# EAGLE design Motorcontroller (EAGLE 9.6.0)
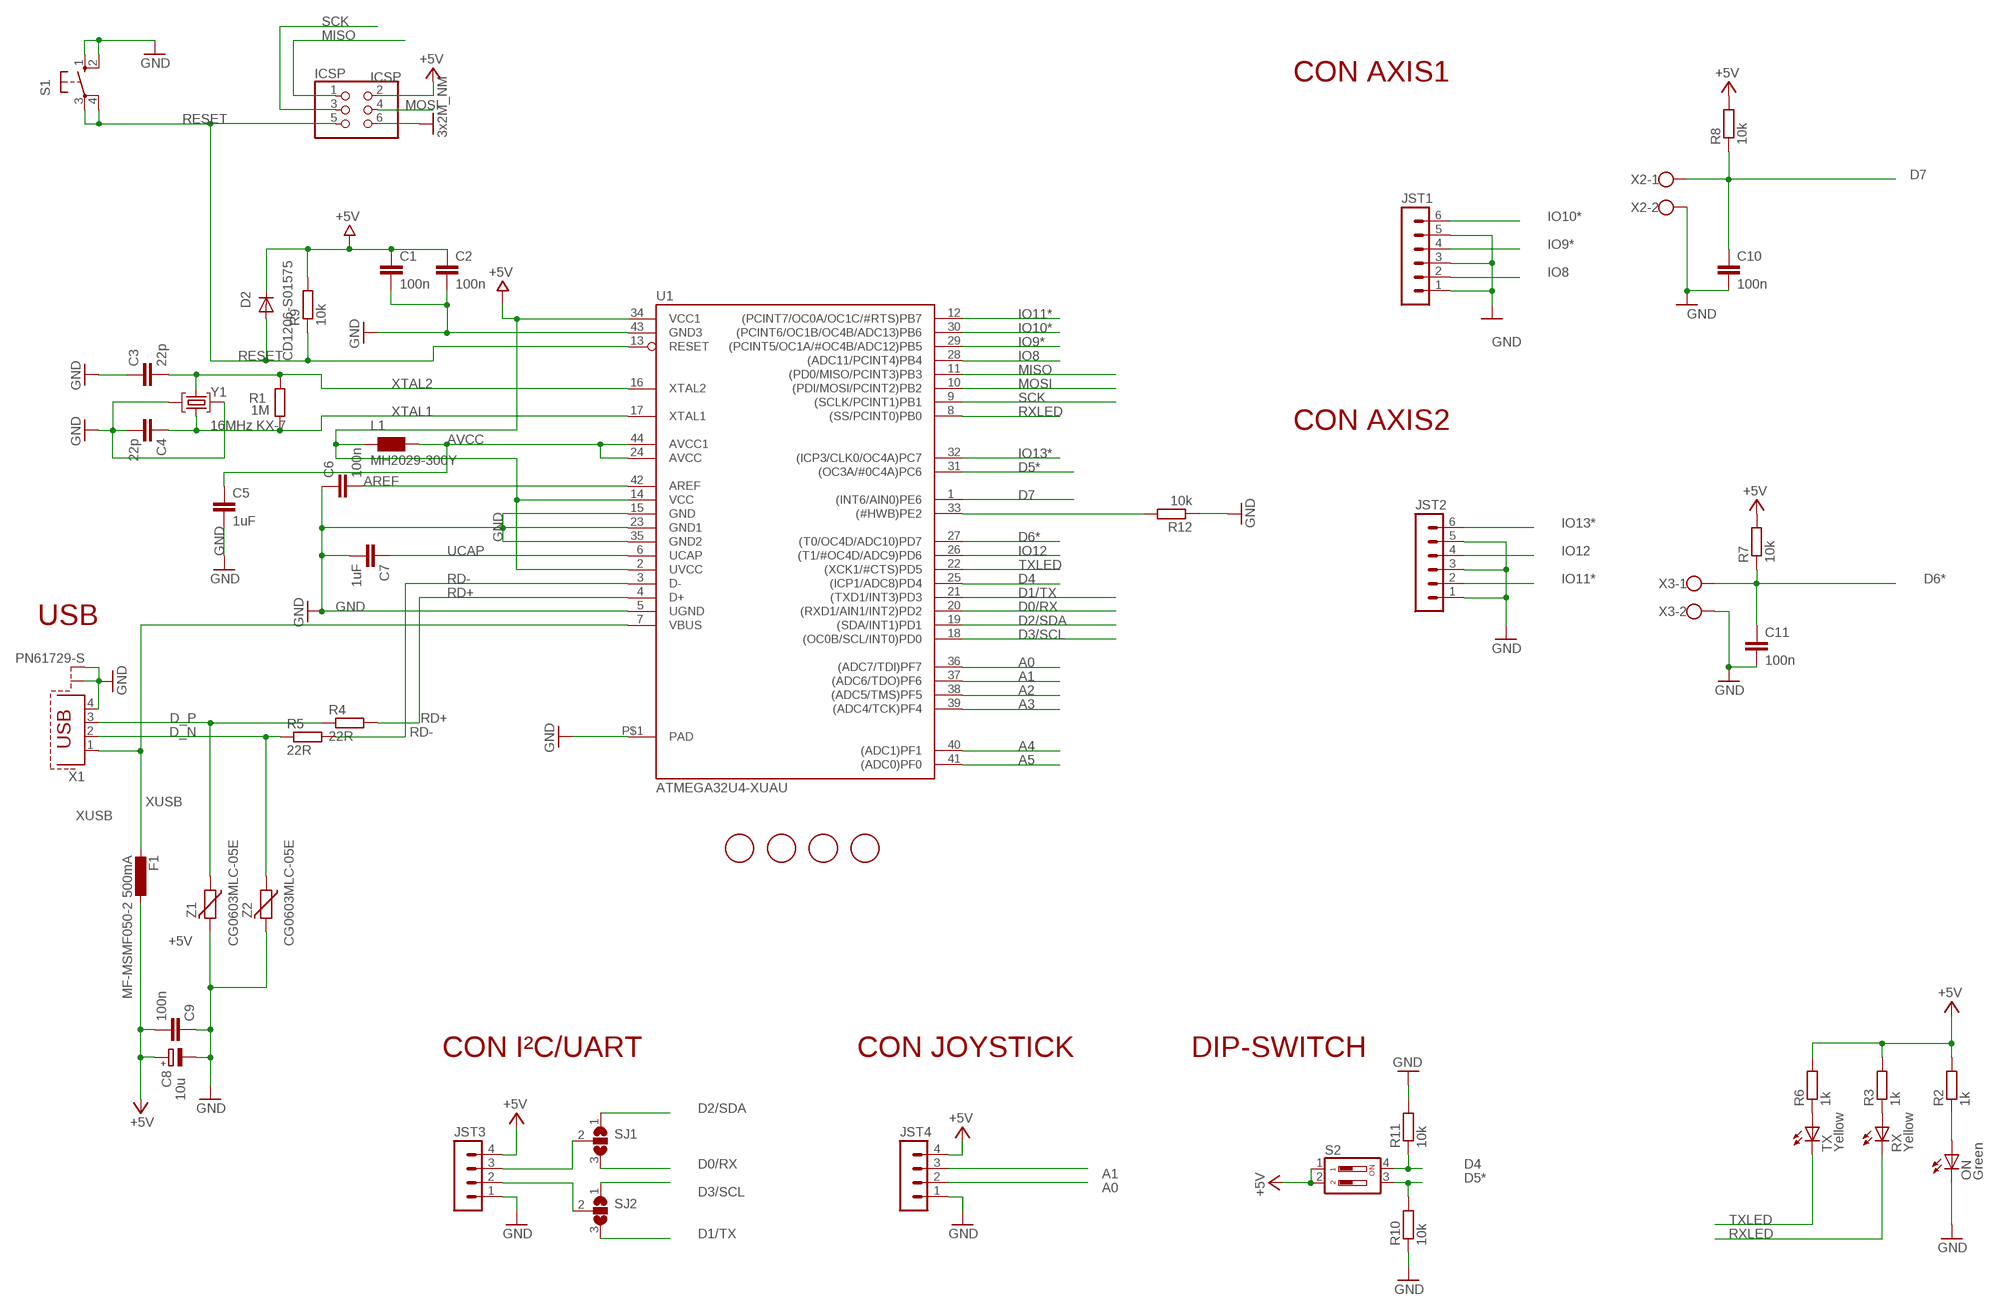
[diagram p0: schematic, sheet 1]

## Parts
C1  100n  C-EUC0805  [C0805]
C2  100n  C-EUC0805  [C0805]
C3  22p  C-EUC0805  [C0805]
C4  22p  C-EUC0805  [C0805]
C5  1uF  C-EUC0805  [C0805]
C6  100n  C-EUC0805  [C0805]
C7  1uF  C-EUC0805  [C0805]
C8  10u  CPOL-EUSMCB  [SMC_B]
C9  100n  C-EUC0805  [C0805]
C10  100n  C-EUC0805  [C0805]
C11  100n  C-EUC0805  [C0805]
D2  CD1206-S01575  DIODE-MINIMELF  [MINIMELF]
F1  MF-MSMF050-2 500mA  L-EUL1812  [L1812]
FID1  FIDUCIALMOUNT  [FIDUCIA-MOUNT]
FID2  FIDUCIALMOUNT  [FIDUCIA-MOUNT]
FID3  FIDUCIALMOUNT  [FIDUCIA-MOUNT]
FID4  FIDUCIALMOUNT  [FIDUCIA-MOUNT]
ICSP  ICSP  PINHD-2X3  [2X03]
JST1  MA06-1  [MA06-1]
JST2  MA06-1  [MA06-1]
JST3  MA04-1  [MA04-1]
JST4  MA04-1  [MA04-1]
L1  MH2029-300Y  WE-CBF_0805  [0805]
ON  Green  LEDCHIPLED_0805  [CHIPLED_0805]
R1  1M  R-EU_R0805  [R0805]
R2  1k  R-EU_R0805  [R0805]
R3  1k  R-EU_R0805  [R0805]
R4  22R  R-EU_R0805  [R0805]
R5  22R  R-EU_R0805  [R0805]
R6  1k  R-EU_R0805  [R0805]
R7  10k  R-EU_R0805  [R0805]
R8  10k  R-EU_R0805  [R0805]
R9  10k  R-EU_R0805  [R0805]
R10  10k  R-EU_R0805  [R0805]
R11  10k  R-EU_R0805  [R0805]
R12  10k  R-EU_R0805  [R0805]
RX  Yellow  LEDCHIPLED_0805  [CHIPLED_0805]
S1  10-XX  [B3F-10XX]
S2  DIP02YL  [DIP02YL]
SJ1  SJ2W  [SJ_2]
SJ2  SJ2W  [SJ_2]
TX  Yellow  LEDCHIPLED_0805  [CHIPLED_0805]
U1  ATMEGA32U4-XUAU  [TQFP44-PAD]
X1  PN61729-S  [PN61729-S]
X2  W237-102  [W237-102]
X3  W237-102  [W237-102]
Y1  16MHz KX-7  CRYSTAL-3.2-2.5  [CRYSTAL-3.2-2.5]
Z1  CG0603MLC-05E  VARISTORCN0805  [CT/CN0805]
Z2  CG0603MLC-05E  VARISTORCN0805  [CT/CN0805]

## Nets
+5V [usbvcc]: C1.1 C2.1 C8.+ C9.2 D2.C F1.1 ICSP.2 JST3.4 JST4.4 L1.1 R2.2 R3.2 R6.2 R7.2 R8.2 R9.2 S2.1 S2.2 U1.2(UVCC) U1.14(VCC) U1.34(VCC1)
A0: JST4.2 U1.36((ADC7/TDI)PF7)
A1: JST4.3 U1.37((ADC6/TDO)PF6)
A2: U1.38((ADC5/TMS)PF5)
A3: U1.39((ADC4/TCK)PF4)
A4: U1.40((ADC1)PF1)
A5: U1.41((ADC0)PF0)
AREF [aref]: C6.2 U1.42(AREF)
AVCC: C5.1 L1.2 U1.24(AVCC) U1.44(AVCC1)
D0/RX: SJ1.3 U1.20((RXD1/AIN1/INT2)PD2)
D1/TX: SJ2.3 U1.21((TXD1/INT3)PD3)
D2/SDA: SJ1.1 U1.19((SDA/INT1)PD1)
D3/SCL: SJ2.1 U1.18((OC0B/SCL/INT0)PD0)
D4: R11.1 S2.4 U1.25((ICP1/ADC8)PD4)
D5*: R10.2 S2.3 U1.31((OC3A/#0C4A)PC6)
D6*: C11.1 R7.1 U1.27((T0/OC4D/ADC10)PD7) X3.1
D7: C10.1 R8.1 U1.1((INT6/AIN0)PE6) X2.1
D_N: R5.1 X1.2 Z2.1
D_P: R4.1 X1.3 Z1.1
GND [gnd]: C1.2 C2.2 C3.1 C4.2 C5.2 C6.1 C7.2 C8.- C9.1 C10.2 C11.2 ICSP.6 JST1.1 JST1.3 JST1.5 JST2.1 JST2.3 JST2.5 JST3.1 JST4.1 ON.C R10.1 R11.2 R12.1 S1.1(S) S1.2(S1) U1.5(UGND) U1.15(GND) U1.23(GND1) U1.35(GND2) U1.43(GND3) U1.P$1(PAD) X1.4 X1.S1 X1.S2 X2.2 X3.2 Y1.2(GND) Y1.4(GND) Z1.2 Z2.2 ; supply symbol labelled 3x2M_NM
IO8: JST1.2 U1.28((ADC11/PCINT4)PB4)
IO9*: JST1.4 U1.29((PCINT5/OC1A/#OC4B/ADC12)PB5)
IO10*: JST1.6 U1.30((PCINT6/OC1B/OC4B/ADC13)PB6)
IO11*: JST2.2 U1.12((PCINT7/OC0A/OC1C/#RTS)PB7)
IO12: JST2.4 U1.26((T1/#OC4D/ADC9)PD6)
IO13*: JST2.6 U1.32((ICP3/CLK0/OC4A)PC7)
MISO: ICSP.1 U1.11((PD0/MISO/PCINT3)PB3)
MOSI: ICSP.4 U1.10((PDI/MOSI/PCINT2)PB2)
N$1: R3.1 RX.A
N$2: R6.1 TX.A
N$3: ON.A R2.1
N$4: JST3.3 SJ1.2
N$5: JST3.2 SJ2.2
N$6: R12.2 U1.33((#HWB)PE2)
RD+: R4.2 U1.4(D+)
RD-: R5.2 U1.3(D-)
RESET: D2.A ICSP.5 R9.1 S1.3(P) S1.4(P1) U1.13(RESET)
RXLED: RX.C U1.8((SS/PCINT0)PB0)
SCK: ICSP.3 U1.9((SCLK/PCINT1)PB1)
TXLED: TX.C U1.22((XCK1/#CTS)PD5)
UCAP: C7.1 U1.6(UCAP)
XTAL1: C4.1 R1.1 U1.17(XTAL1) Y1.1(C1)
XTAL2: C3.2 R1.2 U1.16(XTAL2) Y1.3(C2)
XUSB [usbvcc]: F1.2 U1.7(VBUS) X1.1

## Notes on the sheet
- CON AXIS1
- CON AXIS2
- USB
- CON I²C/UART | CON JOYSTICK | DIP-SWITCH

## Library data of the parts
C1-C7 C9 = SmartPrj:C-EU: CAPACITOR, European symbol
C8 = rcl:CPOL-EU: POLARIZED CAPACITOR, European symbol
C10 C11 = rcl:C-EU: CAPACITOR, European symbol; SPICEPREFIX: C
D2 = diode:DIODE-: DIODE
F1 = rcl:L-EU: INDUCTOR, European symbol
FID1-FID4 = SmartPrj:FIDUCIALMOUNT
ICSP = SmartPrj:PINHD-2X3: PIN HEADER
JST1 JST2 = con-lstb:MA06-1: PIN HEADER; OC_FARNELL: unknown; OC_NEWARK: unknown
JST3 JST4 = con-lstb:MA04-1: PIN HEADER; OC_FARNELL: unknown; OC_NEWARK: unknown
L1 = wuerth-elektronik:WE-CBF: SMD EMI Suppression Ferrite Beads - excellent anti-EMI properties - low DCR - impedances till 3000 ohms - rated current up to 6 A
ON RX TX = led:LED: LED OSRAM: - CHIPLED LG R971, LG N971, LY N971, LG Q971, LY Q971, LO R971, LY R971 LH N974, LH R974 LS Q976, LO Q976, LY Q976 LO Q996 - Hyper CHIPLED LW Q18S LB Q993, LB Q99A, LB R99A - SideLED LS A670, LO A670, LY A670, LG A670, LP A670 LB A673, LV A673, LT A673, LW A673 LH A674 LY A675 LS A676, LA A676, LO A676, LY A676, LW A676 LS A679, LY A679, LG A679 - Hyper Micro SIDELED® LS Y876, LA Y876, LO Y876, LY Y876 LT Y87S - SmartLED LW L88C, LW L88S LB L89C, LB L89S, LG L890 LS L89K, LO L89K, LY L89K LS L896, LA L896, LO L896, LY L896 - TOPLED LS T670, LO T670, LY T670, LG T670, LP T670 LSG T670, LSP T670, LSY T670, LOP T670, LYG T670 LG T671, LOG T671, LSG T671 LB T673, LV T673, LT T673, LW T673 LH T674 LS T676, LA T676, LO T676, LY T676, LB T676, LH T676, LSB T676, LW T676 LB T67C, LV T67C, LT T67C, LS T67K, LO T67K, LY T67K, LW E67C LS E67B, LA E67B, LO E67B, LY E67B, LB E67C, LV E67C, LT E67C LW T67C LS T679, LY T679, LG T679 LS T770, LO T770, LY T770, LG T770, LP T770 LB T773, LV T773, LT T773, LW T773 LH T774 LS E675, LA E675, LY E675, LS T675 LS T776, LA T776, LO T776, LY T776, LB T776 LHGB T686 LT T68C, LB T68C - Hyper Mini TOPLED® LB M676 - Mini TOPLED Santana® LG M470 LS M47K, LO M47K, LY M47K Source: http://www.osram.convergy.de LUXEON: - LUMILED® LXK2-PW12-R00, LXK2-PW12-S00, LXK2-PW14-U00, LXK2-PW14-V00 LXK2-PM12-R00, LXK2-PM12-S00, LXK2-PM14-U00 LXK2-PE12-Q00, LXK2-PE12-R00, LXK2-PE12-S00, LXK2-PE14-T00, LXK2-PE14-U00 LXK2-PB12-K00, LXK2-PB12-L00, LXK2-PB12-M00, LXK2-PB14-N00, LXK2-PB14-P00, LXK2-PB14-Q00 LXK2-PR12-L00, LXK2-PR12-M00, LXK2-PR14-Q00, LXK2-PR14-R00 LXK2-PD12-Q00, LXK2-PD12-R00, LXK2-PD12-S00 LXK2-PH12-R00, LXK2-PH12-S00 LXK2-PL12-P00, LXK2-PL12-Q00, LXK2-PL12-R00 Source: www.luxeon.com KINGBRIGHT: KA-3528ASYC Source: www.kingbright.com
R1 = SmartPrj:R-EU_: RESISTOR, European symbol
R2-R12 = rcl:R-EU_: RESISTOR, European symbol; SPICEPREFIX: R
S1 = switch-omron:10-XX: OMRON SWITCH; MPN: B3F-1000; OC_FARNELL: 176432; OC_NEWARK: 36M3542
S2 = switch-dil:DIP02YL: DIL/CODE SWITCH; OC_FARNELL: unknown; OC_NEWARK: unknown
SJ1 SJ2 = jumper:SJ2W: SMD solder JUMPER
U1 = SmartPrj:ATMEGA32U4-XU
X1 = con-berg:PN61729-S: BERG USB connector; OC_FARNELL: unknown; OC_NEWARK: unknown
X2 X3 = con-wago-500:W237-102: WAGO SCREW CLAMP; MPN: 237-102; OC_FARNELL: unknown; OC_NEWARK: 70K9898
Y1 = SmartPrj:CRYSTAL-3.2-2.5
Z1 Z2 = varistor:VARISTOR: VARISTOR

## Net classes
0 default: width 0.254 mm, drill 0.61 mm, clearance 0.254 mm
1 power: width 0.254 mm, drill 0.61 mm, clearance 0.254 mm
2 gnd: width 0.254 mm, drill 0.61 mm, clearance 0.254 mm
3 usbvcc: width 0.254 mm, drill 0.61 mm, clearance 0.254 mm
4 aref: width 0.254 mm, drill 0.61 mm, clearance 0.254 mm

## Board
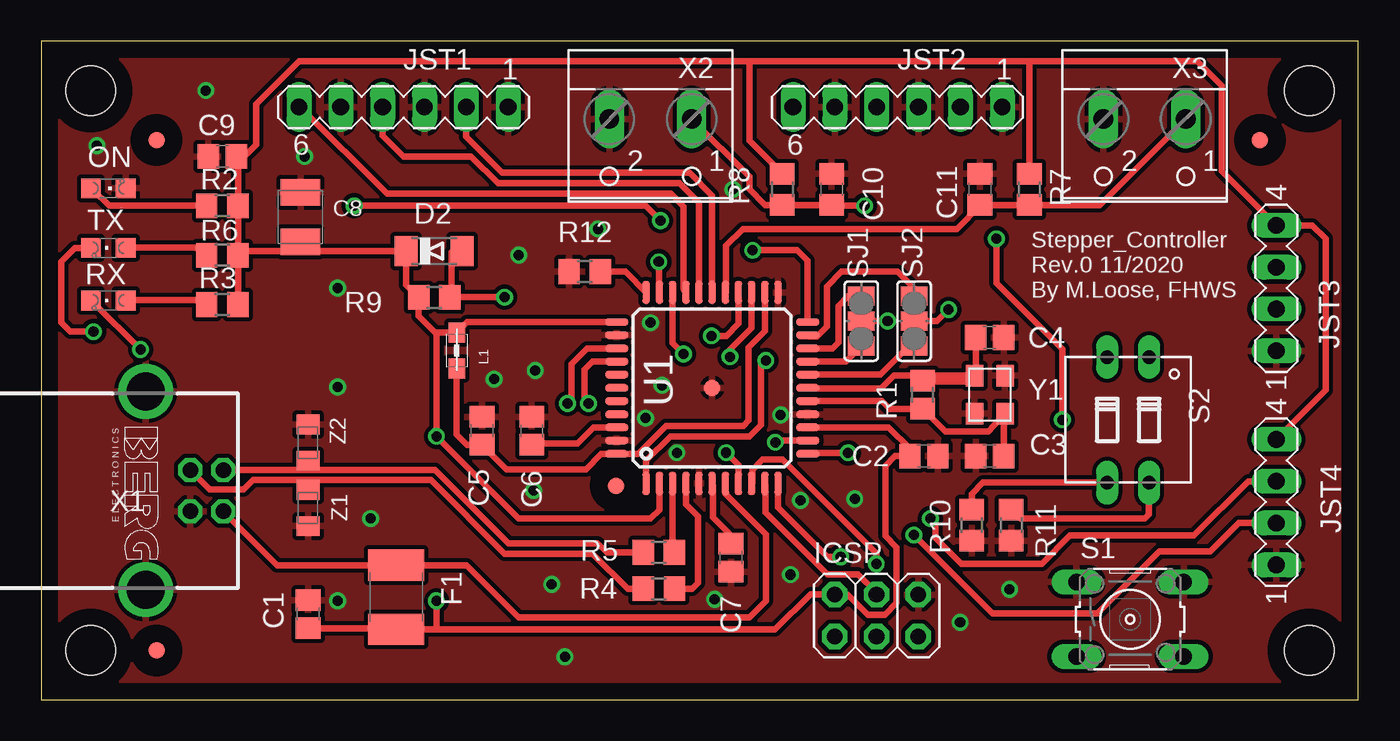
[diagram p1: board, top side]
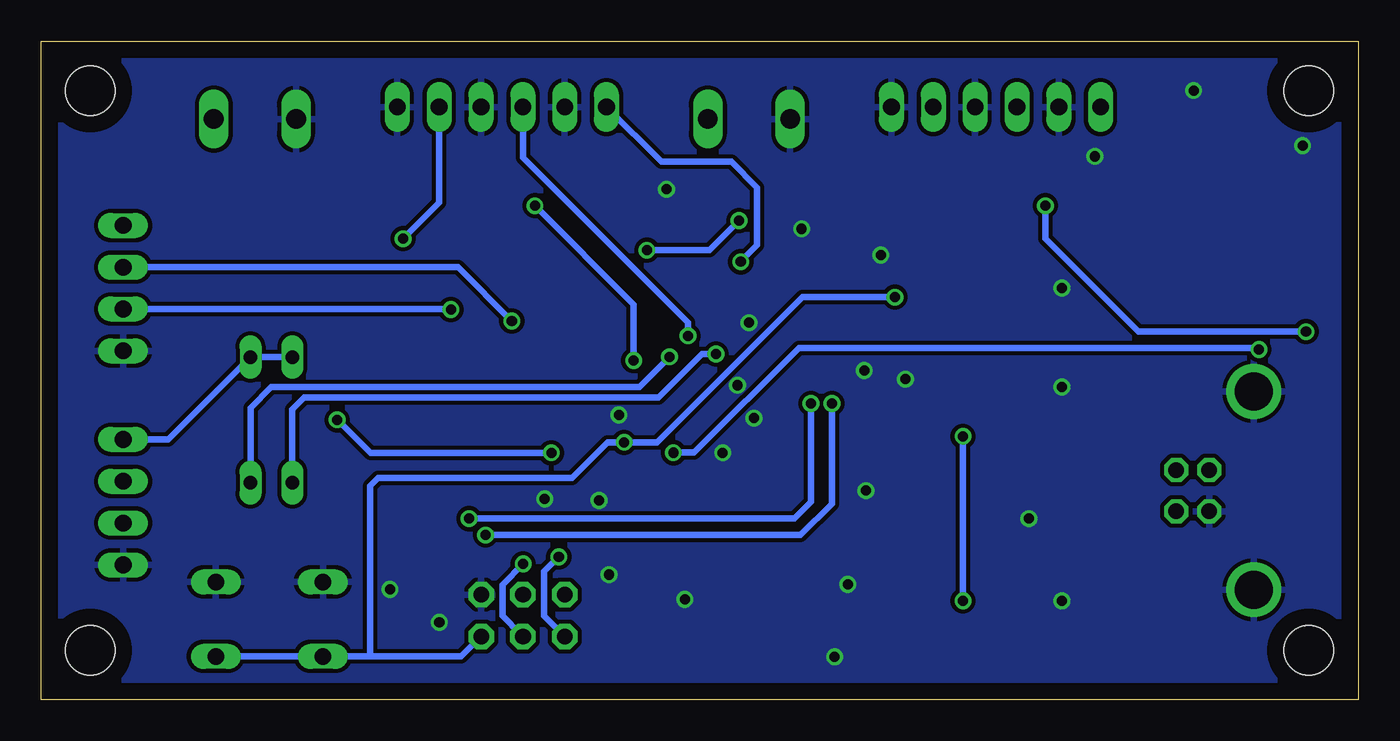
[diagram p2: board, bottom side, seen from below]

Size 79.98 x 40 mm. Coordinates in mm from the lower left corner, seen from the top.
Outline: 0,0 79.98,0 79.98,40 0,40 0,0
Copper layers (1*16): Top 0.035mm / dielectric 1.5mm / Bottom 0.035mm
Design rules "PCBway": minimum track width 6mil, minimum drill 0.3mm, track to track 0.205mm, track to pad 0.205mm, pad to pad 0.205mm, via to via 0.205mm, smd to smd 8mil, copper to edge 40mil, drill to drill 8mil, minimum pad ring 10mil, minimum via ring 8mil, stop-mask expansion 4mil, vias tented up to drill 25mil, thermal gap 10mil
Holes 3 mm at 3,3 3,37 77,37 77,3

### Footprints (pad centres in the part's own frame; a part is rotated, then mirrored left to right if it is on the bottom)
C0805 = smd 1.3 x 1.5: 1 -0.85,0; 2 0.85,0
SMC_B = smd 1.6 x 2.4: + -1.5,0; - 1.5,0
C0805' = smd 1.3 x 1.5: 1 -0.95,0; 2 0.95,0
MINIMELF = smd 1.4 x 1.8: A 1.7,0; C -1.7,0
L1812 = smd 1.9 x 3.4: 1 -1.95,0; 2 1.95,0
FIDUCIA-MOUNT = smd 1.016 x 1.016: P$1 0,0
2X03 = drill 0.95 pad 1.55 octagon: 1 -2.54,-1.27; 2 -2.54,1.27; 3 0,-1.27; 4 0,1.27; 5 2.54,-1.27; 6 2.54,1.27
MA06-1 = drill 1.016 long: 1 -6.35,0; 2 -3.81,0; 3 -1.27,0; 4 1.27,0; 5 3.81,0; 6 6.35,0
MA04-1 = drill 1.016 long: 1 -3.81,0; 2 -1.27,0; 3 1.27,0; 4 3.81,0
0805 = smd 1.2 x 1: 1 -1.1,0; 2 1.1,0
CHIPLED_0805 = smd 1.2 x 1.2: A 0,-1.05; C 0,1.05
R0805 = smd 1.3 x 1.5: 1 -0.85,0; 2 0.85,0
R0805' = smd 1.3 x 1.5: 1 -0.95,0; 2 0.95,0
B3F-10XX = drill 1.016 long: 1 -3.251,2.261; 2 3.251,2.261; 3 -3.251,-2.261; 4 3.251,-2.261
DIP02YL = drill 0.813 long: 1 -1.27,-3.81; 2 1.27,-3.81; 3 1.27,3.81; 4 -1.27,3.81
SJ_2 = smd 1.168 x 1.6: 1 -1.524,0; 2 0,0; 3 1.524,0
TQFP44-PAD = smd 1.4 x 0.45: 1 -5.8,4; 2 -5.8,3.2; 3 -5.8,2.4; 4 -5.8,1.6; 5 -5.8,0.8; 6 -5.8,0; 7 -5.8,-0.8; 8 -5.8,-1.6; 9 -5.8,-2.4; 10 -5.8,-3.2; 11 -5.8,-4; 23 5.8,-4; 24 5.8,-3.2; 25 5.8,-2.4; 26 5.8,-1.6; 27 5.8,-0.8; 28 5.8,0; 29 5.8,0.8; 30 5.8,1.6; 31 5.8,2.4; 32 5.8,3.2; 33 5.8,4 | smd 0.45 x 1.4: 12 -4,-5.8; 13 -3.2,-5.8; 14 -2.4,-5.8; 15 -1.6,-5.8; 16 -0.8,-5.8; 17 0,-5.8; 18 0.8,-5.8; 19 1.6,-5.8; 20 2.4,-5.8; 21 3.2,-5.8; 22 4,-5.8; 34 4,5.8; 35 3.2,5.8; 36 2.4,5.8; 37 1.6,5.8; 38 0.8,5.8; 39 0,5.8; 40 -0.8,5.8; 41 -1.6,5.8; 42 -2.4,5.8; 43 -3.2,5.8; 44 -4,5.8 | smd 1 x 1: P$1 0,0
PN61729-S = drill 0.95 octagon: 1 1.25,4.71; 2 -1.25,4.71; 3 -1.25,2.71; 4 1.25,2.71 | drill 2.3 pad 2.9: S1 -6.02,0; S2 6.02,0
W237-102 = drill 1.194 long: 1 -2.5,-1.27; 2 2.5,-1.27
CRYSTAL-3.2-2.5 = smd 1.3 x 1.05: 1 -1.15,-0.925; 2 1.15,-0.925; 3 1.15,0.925; 4 -1.15,0.925
CT/CN0805 = smd 1.2 x 1.4: 1 -1.1,0; 2 1.1,0

### Placement (x,y rotation side)
C1  16.21,5.19 90 top
C2  53.6,14.8 0 top
C3  57.6,14.8 0 top
C4  57.6,22 0 top
C5  26.77,16.33 90 top
C6  29.79,16.34 270 top
C7  41.89,8.63 270 top
C8  15.75,29.32 90 top
C9  11,33 0 top
C10  100n  [C0805']  48,31 90 top
C11  100n  [C0805']  57,31 90 top
D2  23.87,27.25 0 top
F1  21.56,6.22 90 top
FID1  34.9,13 0 top
FID2  7,3 0 top
FID3  74,34 0 top
FID4  7,34 0 top
ICSP  50.72,5.11 0 top
JST1  22,36 180 top
JST2  52,36 180 top
JST3  75,25 90 top
JST4  75,12 90 top
L1  25.23,21.21 270 top
ON  4.08,31.06 270 top
R1  53.52,18.53 270 top
R2  1k  [R0805']  11,30 0 top
R3  1k  [R0805']  11,24 0 top
R4  22R  [R0805']  37.51,6.75 0 top
R5  22R  [R0805']  37.5,8.95 0 top
R6  1k  [R0805']  11,27 0 top
R7  10k  [R0805']  60,31 90 top
R8  10k  [R0805']  45,31 90 top
R9  10k  [R0805']  23.87,24.44 180 top
R10  10k  [R0805']  56.5,10.6 90 top
R11  10k  [R0805']  58.9,10.6 270 top
R12  10k  [R0805']  33,26 0 top
RX  4.08,24.25 90 top
S1  66.12,4.89 0 top
S2  66,17 180 top
SJ1  49.8,23 90 top
SJ2  53,23 90 top
TX  4.08,27.44 90 top
U1  40.74,18.94 90 top
X1  6.35,12.7 270 top
X2  37,34 180 top
X3  67,34 180 top
Y1  57.6,18.53 270 top
Z1  16.2,11.64 270 top
Z2  16.2,15.62 90 top

### Tracks (layer width: path | path; a pad name or v marks a point on that pad's centre or on a via)
+5V  (via drill 0.61)
  Top 0.254: 25.08,22.38 L1.1 | 22.23,27.1 D2.C | 11.43,27.46 R6.2
  Top 0.381: U1.14 51.46,16.54 52.75,15.25 C2.1 51.85,14.8 51.25,14.2 51.25,9.95 51.94,9.26 51.94,5.88 51.23,5.16 50.22,5.16 48.99,6.38 ICSP.2 48.16,6.4 46.7,6.4 44.57,4.27 24,4.27 | C1.1 21.49,4.34 F1.1 24,4.27 | L1.1 23.92,22.31 22.92,23.31 R9.2 22.17,25.19 D2.C 16,27.25 | 43,38.79 15.65,38.79 13.04,36.18 13.04,33.72 12.38,33.06 C9.2 11.95,32.9 R2.2 R6.2 | 43,38.79 60,38.79 | 60,38.79 70.21,38.79 71.7,37.3 71.7,32.11 JST3.4 77.19,28.81 78,28 78,18.81 JST4.4 74.46,15.27 | 60,38.79 R7.2 | R8.2 43,33.95 43,38.79 | 12.2,27.25 11.64,27.25 | U1.34 25.86,22.94 L1.1 | L1.1 24,22.31 v24,16 29,11 37,11 37.54,11.54 U1.2 | v24,6 24,4.27 | R6.2 R3.2 | R6.2 12.2,27.25 | 12.2,27.25 16,27.25 | C8.+ 16,27.57 16,27.25
  Bottom 0.381: v24,16 v24,6 | S2.2 S2.1 72.27,15.81 JST4.4
A0  (via drill 0.61)
  Top 0.381: U1.36 33.15,21.34 32.2,20.39 32.2,18.23 v31.96,18 | JST4.2 72.73,10.73 71,9 67.89,9 64.13,5.24 57.76,5.24 v53,10
  Bottom 0.381: v31.96,18 31.96,11.9 33.87,10 v53,10
A1  (via drill 0.61)
  Top 0.381: U1.37 33.48,20.54 33,20.06 33,18.23 v33.23,18 | v54,11 54.31,10.69 54.31,9.82 55.87,8.26 60.76,8.26 62.47,9.97 70,9.97 73.3,13.27 JST4.3
  Bottom 0.381: v33.23,18 33.23,12 34.23,11 v54,11
AREF
  Top 0.254: 29.84,15.56 C6.2
  Top 0.381: U1.42 33.54,16.54 32.56,15.56 29.84,15.56
AVCC
  Top 0.381: L1.2 25.23,16.12 25.87,15.48 C5.1 28.25,14 33.08,14 34,14.92 34.92,14.92 U1.44 36.24,14.94 37.94,16.64 42.63,16.64 42.95,16.95 42.95,21.39 43.94,22.39 U1.24
D0/RX
  Top 0.381: U1.20 48.04,21.34 48.4,21.7 48.4,23.92 49,24.52 SJ1.3
D1/TX
  Top 0.381: U1.21 46.61,22.07 47.12,22.07 47.7,22.65 47.7,25.1 48.6,26 52,26 53,25 SJ2.3
D2/SDA
  Top 0.381: U1.19 48.86,20.54 SJ1.1
D3/SCL
  Top 0.381: U1.18 50.95,19.74 52.69,21.48 SJ2.1
D4  (via drill 0.61)
  Top 0.381: U1.25 43.14,22.59 41.83,21.27 v41.83,20.83 | S2.4 67.27,11.27 67,11 59.45,11 R11.1
  Bottom 0.381: v41.83,20.83 43.66,19 66,19 67.27,17.73 S2.4
D5*  (via drill 0.61)
  Top 0.381: R10.2 56.5,12.5 57.19,13.19 S2.3 | U1.31 38.34,21.66 v39,21
  Bottom 0.381: v39,21 39.85,21 42.49,18.36 59,18.36 59.09,18.36 64,18.36 64.73,17.64 S2.3
D6*
  Top 0.381: U1.27 41.59,24.77 41.59,27.59 42.6,28.6 55.6,28.6 57,30 C11.1 R7.1 64.28,30.05 X3.1
D7  (via drill 0.61)
  Top 0.381: X2.1 43,31.77 43,31 43.95,30.05 R8.1 C10.1 48.05,30 v50,30 49.95,30.05 | U1.1 36.74,14.54 38.2,16 43,16 43.7,16.7 43.7,20.3 v44,20.6
  Bottom 0.381: v44,20.6 44,24 v50,30
D_N
  Top 0.381: X1.2 11.27,13.95 11.29,13.97 16,13.97 | 16,13.97 23.93,13.97 28.39,9.51 33.78,9.51 34.35,8.95 R5.1 | Z2.1 16.2,14.17 16,13.97
D_P
  Top 0.381: X1.3 10.23,12.78 12.31,12.78 12.87,13.34 16,13.34 | 16,13.34 23.66,13.34 28.13,8.87 33.49,8.87 35.62,6.75 R4.1 | Z1.1 16,12.95 16,13.34
GND  (via drill 0.61)
  other vias: 20,11 31,7 18,6 27.5,19.47 36.7,17.1 40.89,6.1 42,31 3.38,33.66 10,37 30,20 29,27 29.9,12.7 38.6,15 18,25 18,19 33.8,28.6 16,33 31.8,2.6 49.4,12.2 45.5,7.6 37.7,19.1 37,22.9 44.9,17.3 46.1,12.1 58.8,6.7 55.8,4.7
  pour Top: 0,40 0,0 80,0 80,40
  pour Top: 0,40 80,40 80,0 0,0
  pour Bottom: 0,40 80,40 80,0 0,0
IO8
  Top 0.381: U1.28 40.74,30.62 39.37,32 28,32 25.81,34.19 JST1.2
IO9*
  Top 0.381: U1.29 39.94,30.19 38.76,31.36 27.74,31.36 26.1,33 22,33 20.73,34.27 JST1.4
IO10*
  Top 0.381: U1.30 39.07,24.81 39.01,25 39.01,29.96 38.24,30.73 20.99,30.73 15.72,36 JST1.6
IO11*  (via drill 0.61)
  Top 0.381: U1.12 46.6,15 v49,15 | v62,17 62,21.3 58,25.3 v58,28
  Bottom 0.381: v49,15 59.97,15 61.97,17 v62,17 | v58,28 55.81,30.19 JST2.2
IO12  (via drill 0.61)
  Top 0.381: U1.26 42.34,22.84 41.6,22.1 v40.7,22.1
  Bottom 0.381: v40.7,22.1 40.7,22.9 50.73,32.93 JST2.4
IO13*  (via drill 0.61)
  Top 0.381: v37.5,26.6 37.5,24.78 U1.32
  Bottom 0.381: JST2.6 42.33,32.67 38.08,32.67 36.5,31.1 36.5,27.6 v37.5,26.6
MISO  (via drill 0.61)
  Top 0.381: v48.55,8.67 47.75,8.67 44.74,11.68 U1.11
  Bottom 0.381: v48.55,8.67 49.44,7.79 49.44,5.08 48.32,3.97 ICSP.1
MOSI
  Top 0.381: U1.10 43.97,13.02 43.97,11.38 47.74,7.62 49.59,7.62 50.7,6.51 ICSP.4
N$1
  Top 0.381: RX.A 5.24,24.29 9.37,24.29 R3.1
N$2
  Top 0.381: TX.A 5.24,27.46 9.37,27.46 R6.1
N$3
  Top 0.381: ON.A 3.17,30.96 4.13,30 9.41,30 9.85,30.44 9.89,30.16 R2.1
N$4  (via drill 0.61)
  Top 0.381: SJ1.2 v51.4,23
  Bottom 0.381: v51.4,23 54.67,26.27 JST3.3
N$5  (via drill 0.61)
  Top 0.381: SJ2.2 54.4,23 v55.1,23.7
  Bottom 0.381: JST3.2 55.13,23.73 v55.1,23.7
N$6
  Top 0.381: R12.2 35.48,26 U1.33
RD+
  Top 0.381: U1.4 39.14,11.86 39.87,11.13 39.87,7.1 39.52,6.75 R4.2
RD-
  Top 0.381: U1.3 38.34,9.05 R5.2
RESET  (via drill 0.61)
  Top 0.381: D2.A 24.92,27.2 24.92,24.45 R9.1 25.08,24.45 v28.13,24.45 | U1.13 44.68,15.74 v44.58,15.64
  Bottom 0.381: ICSP.5 54.47,2.63 60,2.63 | 60,2.63 S1.3 S1.4 | 60,2.63 60,13 59.52,13.48 47.74,13.48 45.58,15.64 v44.58,15.64 42.58,15.64 33.77,24.45 v28.13,24.45
RXLED  (via drill 0.61)
  Top 0.381: v6.03,21.27 3.17,24.13 RX.C | v41.59,15.01 42.33,14.27 42.33,13.14 U1.8
  Bottom 0.381: v6.03,21.27 6.13,21.37 33,21.37 33.29,21.37 33.98,21.37 40.34,15.01 v41.59,15.01
SCK  (via drill 0.61)
  Top 0.381: v50.7,8.26 50.7,8.9 45.02,14.59 43.8,14.59 43.18,13.97 43.18,13.18 U1.9
  Bottom 0.381: v50.7,8.26 51.98,6.99 51.98,5.08 50.86,3.97 ICSP.3
TXLED  (via drill 0.61)
  Top 0.381: v37.6,29.1 36.7,30 v19,30 | TX.C 2.03,27.44 1.21,26.62 1.21,22.92 1.78,22.35 v3.17,22.35 | U1.22 46.54,26.66 45.9,27.3 v43.2,27.3
  Bottom 0.381: v19,30 19,28 13.35,22.35 v3.17,22.35 | v43.2,27.3 39.4,27.3 v37.6,29.1
UCAP
  Top 0.381: U1.6 40.8,13.02 40.8,11.06 41.73,10.14 41.89,9.93 C7.1
XTAL1
  Top 0.381: U1.17 46.67,18.89 51,18.89 51.79,19.68 Y1.1 | R1.1 53.4,19.34 56.33,19.34 Y1.1 | C4.1 56.75,19.75 Y1.1
XTAL2
  Top 0.381: U1.16 51.04,18.14 51.53,17.65 53.49,17.65 R1.2 54.91,16.28 57.53,16.28 Y1.3 58.45,17.3 C3.2
XUSB
  Top 0.254: 41.59,13.02 U1.7
  Top 0.381: X1.1 14.34,8.17 F1.2 25.83,8.17 29,5 43,5 44,6 44,10.03 41.54,12.49 U1.7

### Text on the board
tNames: Stepper_Controller / Rev.0 11/2020 / By M.Loose, FHWS